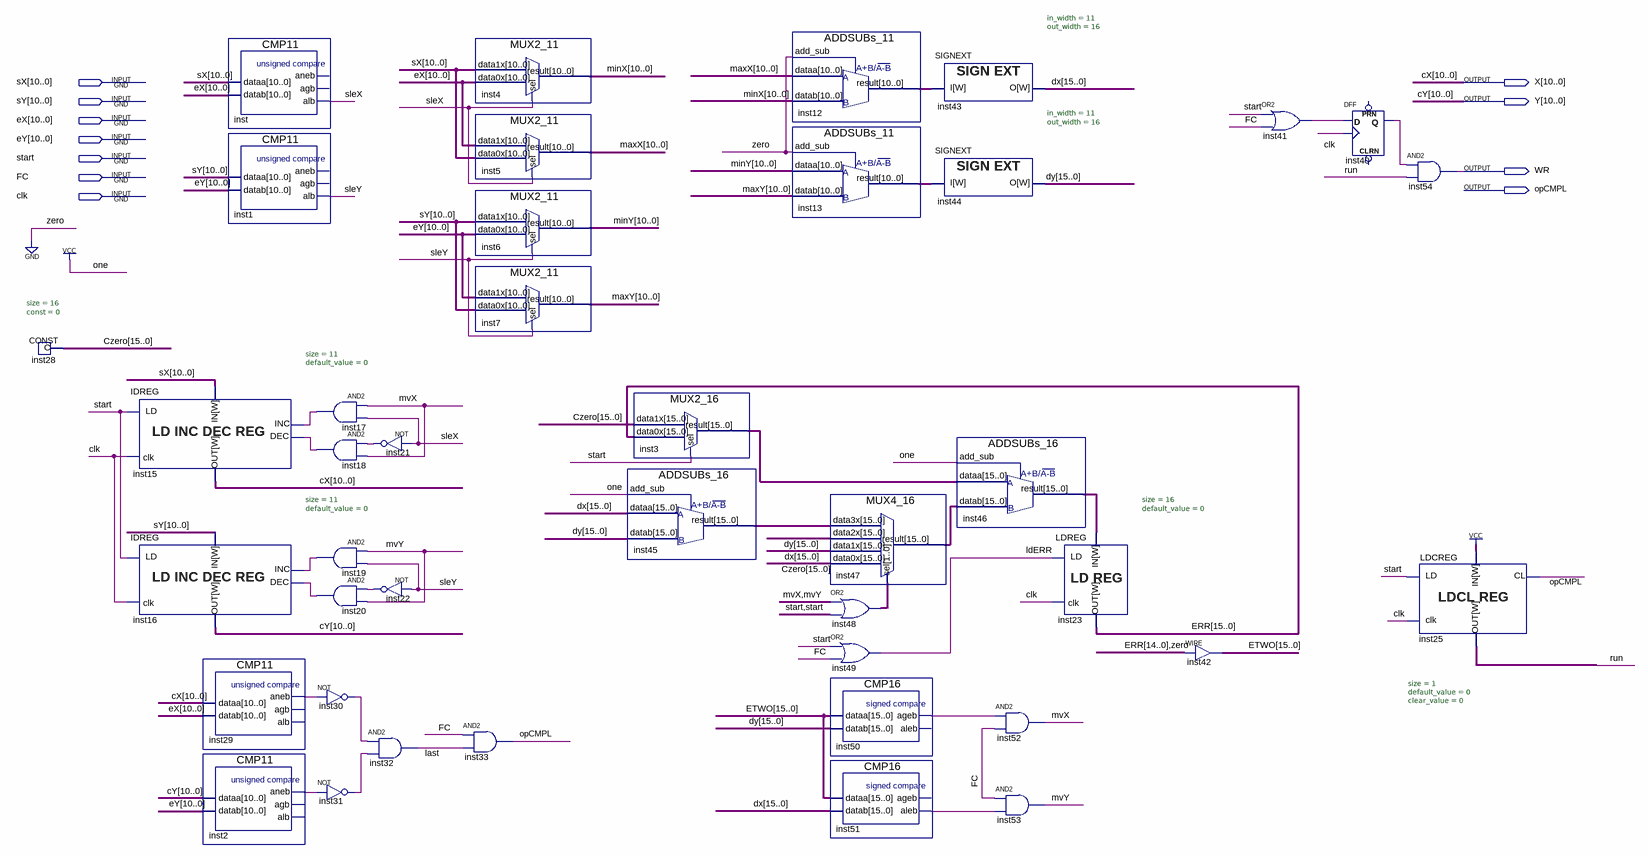
[diagram p0: schematic sheet]
// Quartus schematic LineDrawer.bdf as structural Verilog: 41 symbols, 11 pins
module LineDrawer (
  input  [10:0] sX,
  input  [10:0] sY,
  input  [10:0] eX,
  input  [10:0] eY,
  input  start,
  input  FC,
  input  clk,
  output [10:0] X,
  output [10:0] Y,
  output WR,
  output opCMPL
);

  wire inst2_aneb, inst17_out, inst18_out, inst19_out, inst20_out, inst21_out, inst22_out, inst25_data_out,
       inst29_aneb, inst30_out, inst31_out, inst40_q, inst41_out, inst50_ageb, inst51_aleb, last, ldERR, mvX,
       mvY, run, sleX, sleY;
  wire [1:0] inst48_out;
  wire [10:0] inst12_result, inst13_result, maxX, maxY, minX, minY;
  wire [15:0] Czero, dx, dy, ERR, ETWO, inst3_result, inst45_result, inst46_result, inst47_result;

  CONST #(.size(16), .\const (0)) inst28 (.data(Czero));
  IDREG #(.size(11), .default_value(0)) inst15 (
    .clk(clk), .data_in(sX), .inc(inst17_out), .dec(inst18_out), .ld(start), .data_out(X));
  IDREG #(.size(11), .default_value(0)) inst16 (
    .clk(clk), .data_in(sY), .inc(inst19_out), .dec(inst20_out), .ld(start), .data_out(Y));
  CMP11 inst (.dataa(sX), .datab(eX), .alb(sleX));  // open: aneb, agb
  CMP11 inst1 (.dataa(sY), .datab(eY), .alb(sleY));  // open: aneb, agb
  CMP11 inst29 (.dataa(X), .datab(eX), .aneb(inst29_aneb));  // open: agb, alb
  CMP11 inst2 (.dataa(Y), .datab(eY), .aneb(inst2_aneb));  // open: agb, alb
  and inst17 (inst17_out, mvX, sleX);
  and inst18 (inst18_out, inst21_out, mvX);
  and inst19 (inst19_out, mvY, sleY);
  and inst20 (inst20_out, inst22_out, mvY);
  not inst30 (inst30_out, inst29_aneb);
  not inst31 (inst31_out, inst2_aneb);
  not inst21 (inst21_out, sleX);
  not inst22 (inst22_out, sleY);
  and inst32 (last, inst30_out, inst31_out);
  MUX2_11 inst4 (.data1x(sX), .data0x(eX), .sel(sleX), .result(minX));
  MUX2_11 inst5 (.data1x(eX), .data0x(sX), .sel(sleX), .result(maxX));
  MUX2_11 inst6 (.data1x(sY), .data0x(eY), .sel(sleY), .result(minY));
  MUX2_11 inst7 (.data1x(eY), .data0x(sY), .sel(sleY), .result(maxY));
  and inst33 (opCMPL, FC, last);
  MUX2_16 inst3 (.data1x(Czero), .data0x(ERR), .sel(start), .result(inst3_result));
  ADDSUBs_16 inst45 (.add_sub(1'b1), .dataa(dx), .datab(dy), .result(inst45_result));
  ADDSUBs_11 inst12 (.add_sub(1'b0), .dataa(maxX), .datab(minX), .result(inst12_result));
  ADDSUBs_11 inst13 (.add_sub(1'b0), .dataa(minY), .datab(maxY), .result(inst13_result));
  MUX4_16 inst47 (
    .data3x(inst45_result), .data2x(dy), .data1x(dx), .data0x(Czero), .sel(inst48_out), .result(inst47_result));
  assign inst48_out = {mvX, mvY} | {2{start}};  // OR2 inst48, 2 bits wide
  or inst49 (ldERR, start, FC);
  CMP16 inst50 (.dataa(ETWO), .datab(dy), .ageb(inst50_ageb));  // open: aleb
  CMP16 inst51 (.dataa(ETWO), .datab(dx), .aleb(inst51_aleb));  // open: ageb
  SIGNEXT #(.in_width(11), .out_width(16)) inst43 (.I(inst12_result), .O(dx));
  SIGNEXT #(.in_width(11), .out_width(16)) inst44 (.I(inst13_result), .O(dy));
  ADDSUBs_16 inst46 (.add_sub(1'b1), .dataa(inst3_result), .datab(inst47_result), .result(inst46_result));
  and inst52 (mvX, inst50_ageb, FC);
  and inst53 (mvY, FC, inst51_aleb);
  LDREG #(.size(16), .default_value(0)) inst23 (.clk(clk), .data_in(inst46_result), .ld(ldERR), .data_out(ERR));
  assign ETWO = {ERR[14:0], 1'b0};  // WIRE inst42
  or inst41 (inst41_out, start, FC);
  DFF inst40 (.CLK(clk), .D(inst41_out), .Q(inst40_q));  // open: CLRN, PRN
  and inst54 (WR, inst40_q, run);
  LDCREG #(.size(1), .default_value(0), .clear_value(0)) inst25 (
    .clk(clk), .data_in(1'b1), .cl(opCMPL), .ld(start), .data_out(inst25_data_out));

  // Other names for the same wires on the sheet: cX[10:0] = X; cY[10:0] = Y
endmodule
